# EAGLE schematic MainBoard_V0.5 (EAGLE 9.2.2)
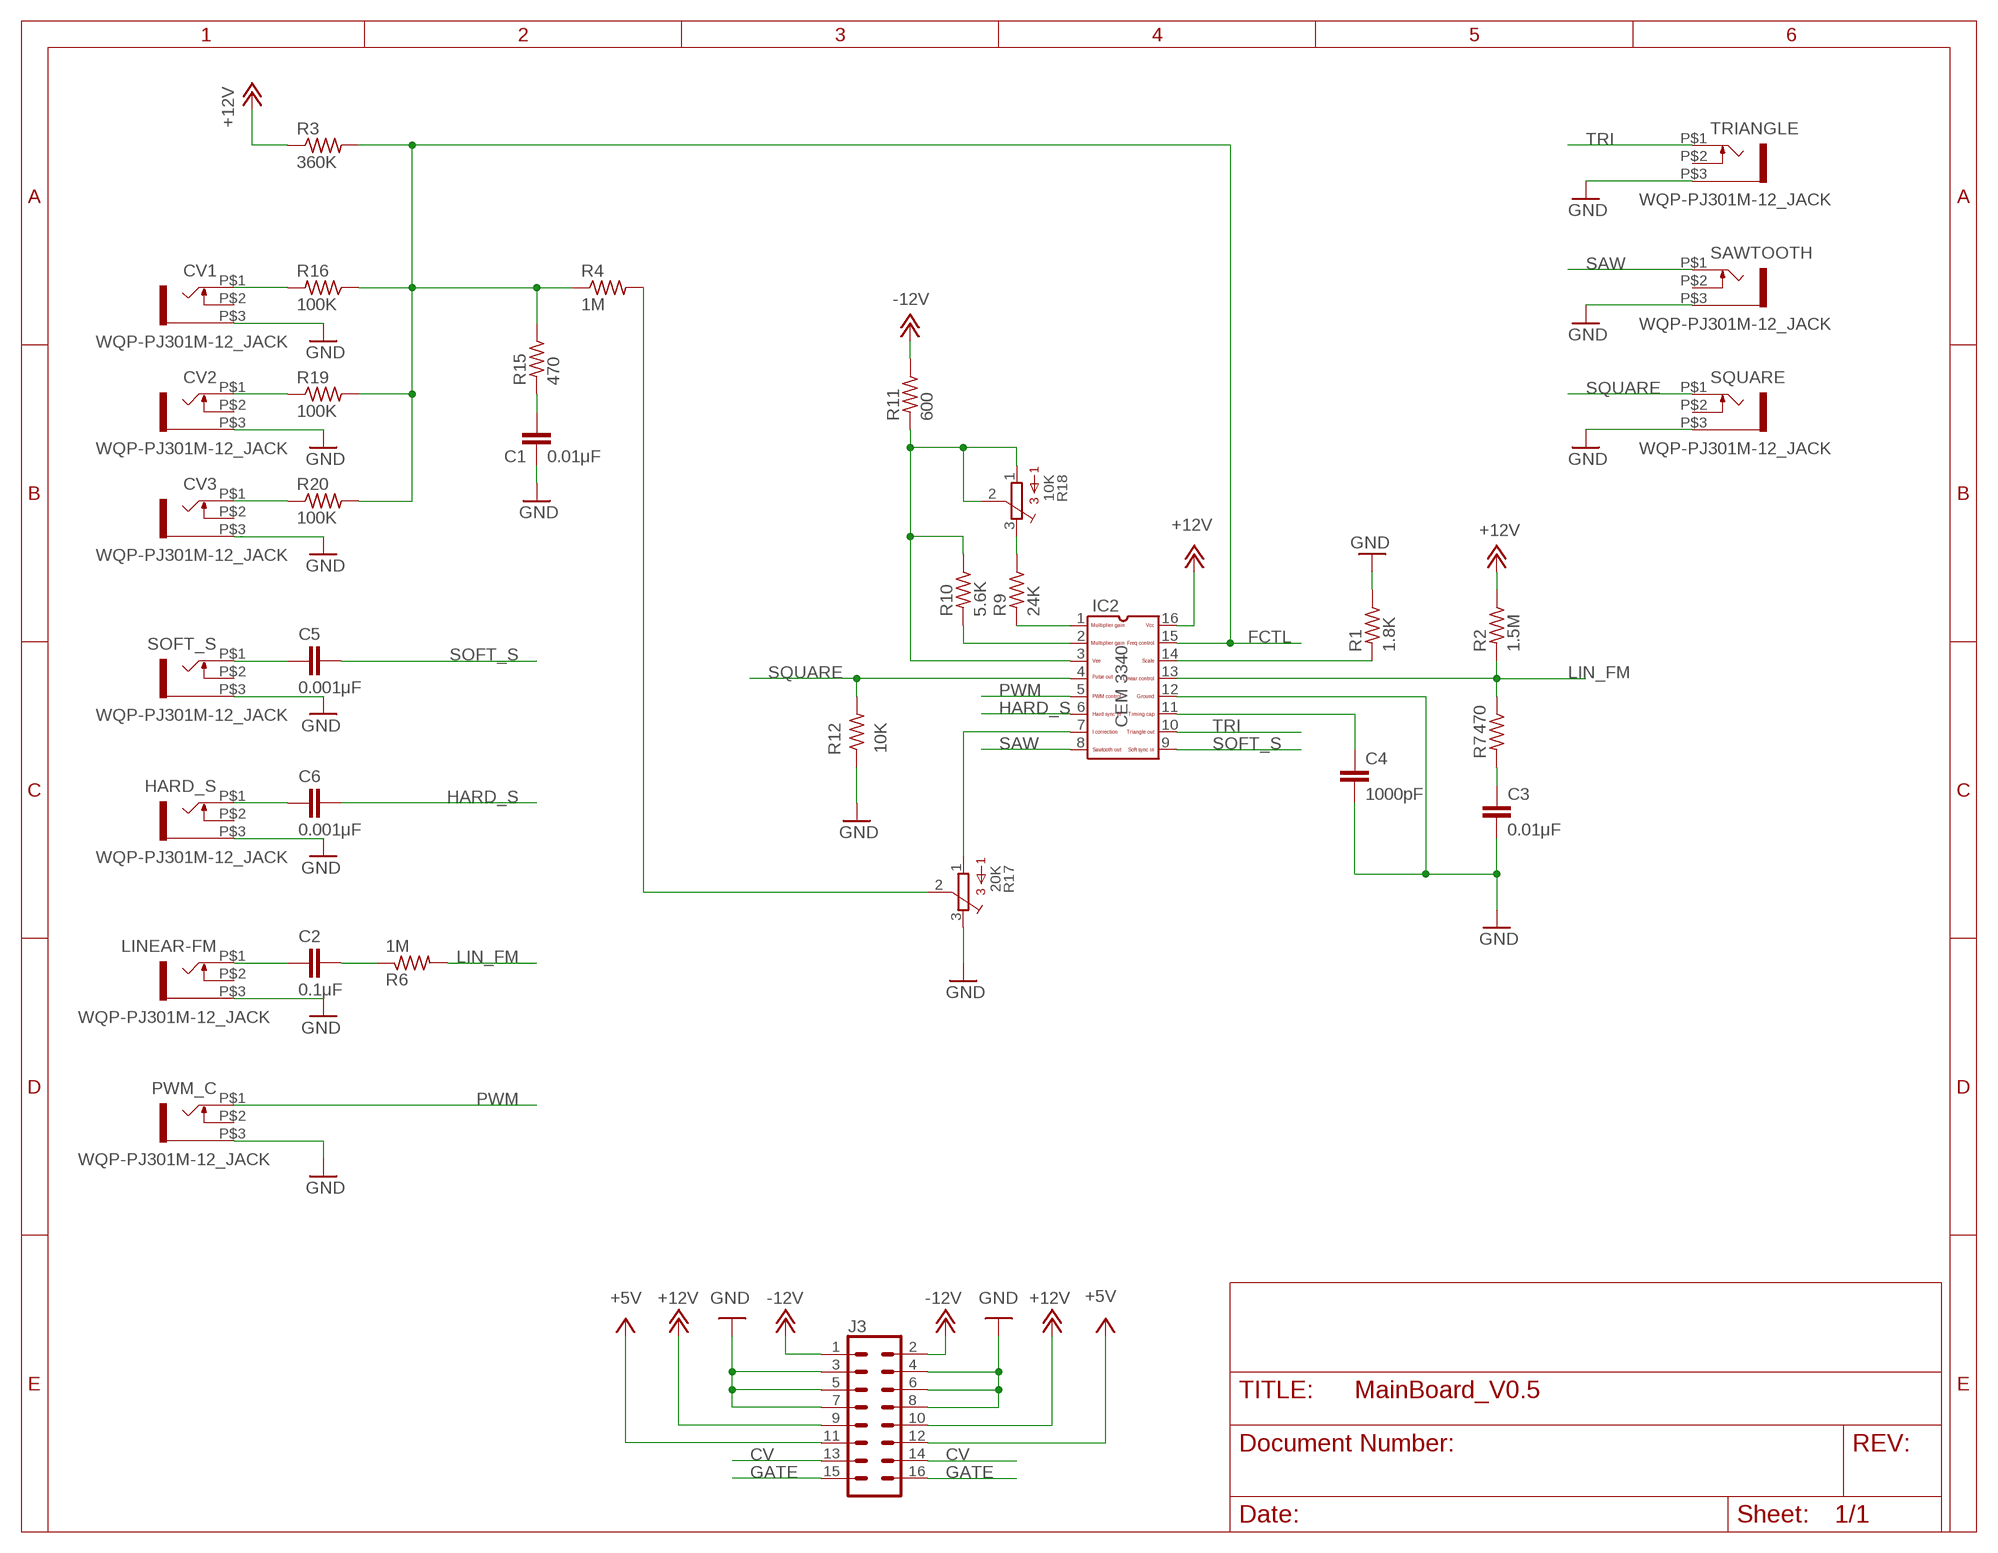
[diagram p0: schematic, sheet 1]

## Parts
C1  0.01μF  C-EU050-025X075  [C050-025X075]
C2  0.1μF  C-EU050-025X075  [C050-025X075]
C3  0.01μF  C-EU050-025X075  [C050-025X075]
C4  1000pF  C-EU050-025X075  [C050-025X075]
C5  0.001μF  C-EU050-025X075  [C050-025X075]
C6  0.001μF  C-EU050-025X075  [C050-025X075]
CV1  WQP-PJ301M-12_JACK  [WQP-PJ301M-12_JACK]
CV2  WQP-PJ301M-12_JACK  [WQP-PJ301M-12_JACK]
CV3  WQP-PJ301M-12_JACK  [WQP-PJ301M-12_JACK]
HARD_S  WQP-PJ301M-12_JACK  [WQP-PJ301M-12_JACK]
IC2  CEM3340  [DIL16]
J3  CONN_08X2_SHROUD  [2X8-SHROUDED_LOCK]
LINEAR-FM  WQP-PJ301M-12_JACK  [WQP-PJ301M-12_JACK]
PWM_C  WQP-PJ301M-12_JACK  [WQP-PJ301M-12_JACK]
R1  1.8K  R-US_0207/10  [0207/10]
R2  1.5M  R-US_0207/10  [0207/10]
R3  360K  R-US_0207/10  [0207/10]
R4  1M  R-US_0207/10  [0207/10]
R6  1M  R-US_0207/10  [0207/10]
R7  470  R-US_0207/10  [0207/10]
R9  24K  R-US_0207/10  [0207/10]
R10  5.6K  R-US_0207/10  [0207/10]
R11  600  R-US_0207/10  [0207/10]
R12  10K  R-US_0207/10  [0207/10]
R15  470  R-US_0207/10  [0207/10]
R16  100K  R-US_0207/10  [0207/10]
R17  20K  3386-W  [3386W]
R18  10K  3386-W  [3386W]
R19  100K  R-US_0207/10  [0207/10]
R20  100K  R-US_0207/10  [0207/10]
SAWTOOTH  WQP-PJ301M-12_JACK  [WQP-PJ301M-12_JACK]
SOFT_S  WQP-PJ301M-12_JACK  [WQP-PJ301M-12_JACK]
SQUARE  WQP-PJ301M-12_JACK  [WQP-PJ301M-12_JACK]
TRIANGLE  WQP-PJ301M-12_JACK  [WQP-PJ301M-12_JACK]

## Nets
+5V: J3.11 J3.12
+12V: IC2.16 J3.9 J3.10 R2.1 R3.1
-12V: J3.1 J3.2 R11.1
CV: J3.13 J3.14
FCTL: IC2.15 R3.2 R4.1 R15.1 R16.1 R19.2 R20.2
GATE: J3.15 J3.16
GND: C1.2 C3.2 C4.2 CV1.P$3 CV2.P$3 CV3.P$3 HARD_S.P$3 IC2.12 J3.3 J3.4 J3.5 J3.6 J3.7 J3.8 LINEAR-FM.P$3 PWM_C.P$3 R1.1 R12.1 R17.3 SAWTOOTH.P$3 SOFT_S.P$3 SQUARE.P$3 TRIANGLE.P$3
HARD_S: C6.2 IC2.6
LIN_FM: IC2.13 R2.2 R6.2 R7.1
N$1: IC2.2 R10.2
N$2: C1.1 R15.2
N$3: IC2.14 R1.2
N$4: C2.1 LINEAR-FM.P$1
N$5: C2.2 R6.1
N$6: C3.1 R7.2
N$7: C4.1 IC2.11
N$8: IC2.1 R9.2
N$10: R4.2 R17.2
N$11: R9.1 R18.3
N$13: IC2.7 R17.1
N$14: CV1.P$1 R16.2
N$15: IC2.3 R10.1 R11.2 R18.1 R18.2
N$16: C6.1 HARD_S.P$1
N$20: CV2.P$1 R19.1
N$22: CV3.P$1 R20.1
N$29: C5.2 SOFT_S.P$1
PWM: IC2.5 PWM_C.P$1
SAW: IC2.8 SAWTOOTH.P$1
SOFT_S: C5.1 IC2.9
SQUARE: IC2.4 R12.2 SQUARE.P$1
TRI: IC2.10 TRIANGLE.P$1
Unconnected: CV1.P$2 CV2.P$2 CV3.P$2 HARD_S.P$2 LINEAR-FM.P$2 PWM_C.P$2 SAWTOOTH.P$2 SOFT_S.P$2 SQUARE.P$2 TRIANGLE.P$2

## Library data of the parts
C1-C6 = rcl:C-EU: CAPACITOR, European symbol; SPICEPREFIX: C
CV1 CV3 HARD_S LINEAR-FM PWM_C SAWTOOTH SOFT_S SQUARE TRIANGLE = thonkiconn:WQP-PJ301M-12_JACK
CV2 = thonkiconn:WQP-PJ301M-12_JACK; SPICEPREFIX: U
IC2 = CEM:CEM3340: CEM 3340 VCO
J3 = SparkFun-Connectors:CONN_08X2: Multi connection point. Often used as Generic Header-pin footprint for 0.1 inch spaced/style header connections You can populate with any combo of single row headers, but if you'd like an exact match, check this: Header - 2x8 (Male, 0.1") <https://www.sparkfun.com/products/13156> (PRT-13156) On any of the 0.1 inch spaced packages, you can populate with these: Break Away Headers - Straight <https://www.sparkfun.com/products/116> (PRT-00116) Break Away Male Headers - Right Angle <https://www.sparkfun.com/products/553> (PRT-00553) Female Headers <https://www.sparkfun.com/products/115> (PRT-00115) Break Away Headers - Machine Pin <https://www.sparkfun.com/products/117> (PRT-00117) Break Away Female Headers - Swiss Machine Pin <https://www.sparkfun.com/products/743> (PRT-00743)
R1-R4 R6 R7 R9-R12 R15 R16 R19 R20 = rcl:R-US_: RESISTOR, American symbol; SPICEPREFIX: R
R17 R18 = bourns:3386-: 3386 Series 3/8" Square Trimmer

## Net classes
0 default: width 0.61 mm, drill 0.254 mm, clearance 0.305 mm